# Altium schematic sheet LED_Sensor.SchDoc
size A4; SheetNumber: 3; SheetTotal: 5
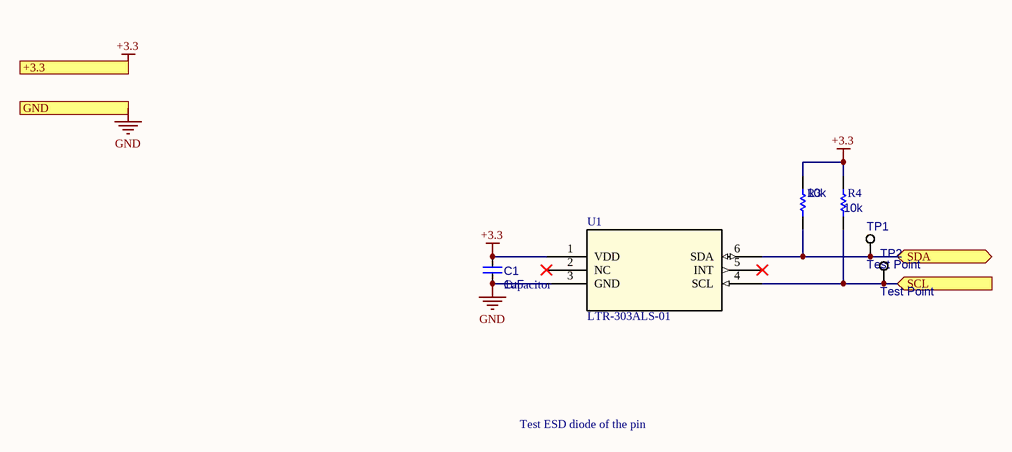
[diagram p0: LED_Sensor.SchDoc]

## Parts
C1  Capacitor  value 1uF  [C0603B]
R3  value 10k  [R0603B]  (hidden comment: Resistor)
R4  value 10k  [R0603B]  (hidden comment: Resistor)
TP1  Test Point  [TP-TH]  (no BOM)
TP2  Test Point  [TP-TH]  (no BOM)
U1  LTR-303ALS-01  [LTR-303ALS-01_LTO]

## Ports
+3.3 (in), GND, SCL (in), SDA (bidir)

## Nets
+3.3: C1.2 R3.2 R4.2 U1.1(VDD) ; port +3.3
GND: C1.1 U1.3(GND) ; port GND
SCL: R4.1 TP2.1(Pad) U1.4(SCL) ; port SCL
SDA: R3.1 TP1.1(Pad) U1.6(SDA) ; port SDA

Not connected (* = marked no-connect by the designer): U1 2(NC)* 5(INT)*

## Notes on the sheet
- Test ESD diode of the pin

## Library data of the parts
C1 = CMP-001-00000-10: Non-polarized capacitor
R3 R4 = CMP-009-00002-14
TP1 TP2 = CMP-002-00006-6: In circuit test point for a net
U1 = CMP-197-000003-1: No Description Available; Mfr_Name: LITE-ON; Type: Type; Design Item ID: LTR-303ALS-01; Source: LTR-303ALS-01.SchLib; RefDes: RefDes